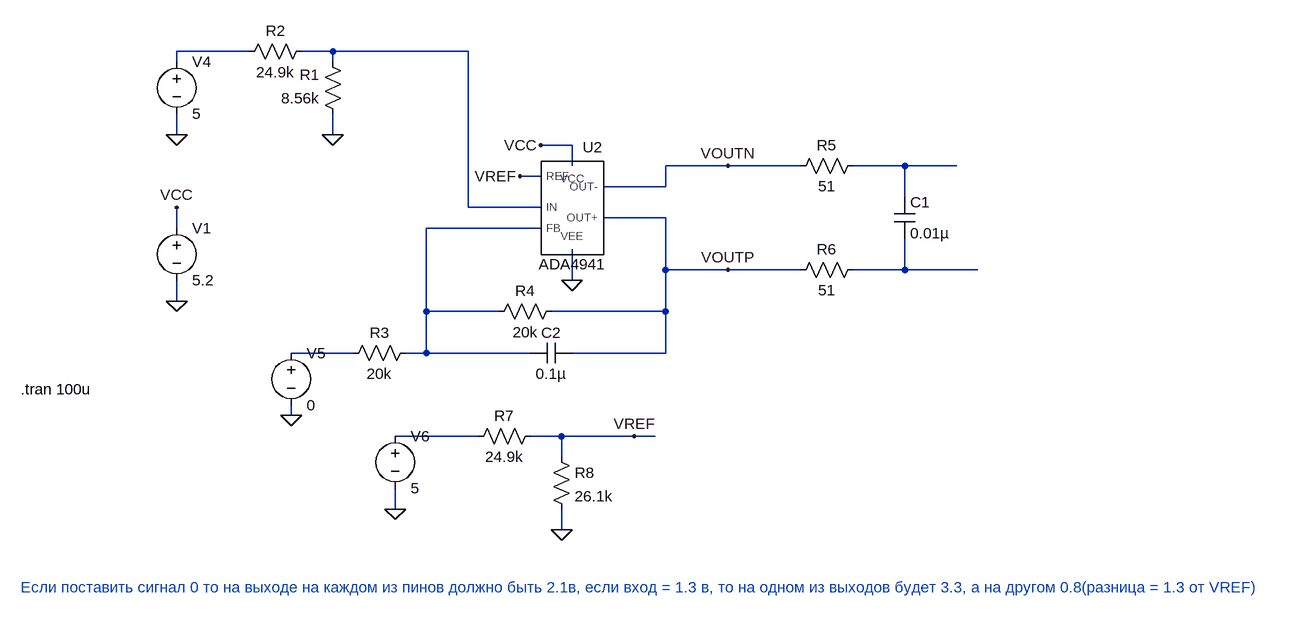
[diagram p0: schematic ADCDriverMEASI.asc]
ADCDriverMEASI.asc, the LTspice schematic file:
Version 4.1
SHEET 1 1264 680
WIRE -448 -208 -560 -208
WIRE -320 -208 -368 -208
WIRE -112 -208 -320 -208
WIRE -560 -192 -560 -208
WIRE -320 -192 -320 -208
WIRE -560 -80 -560 -112
WIRE -320 -80 -320 -112
WIRE 48 -64 0 -64
WIRE 48 -32 48 -64
WIRE 288 -32 192 -32
WIRE 400 -32 288 -32
WIRE 560 -32 480 -32
WIRE 640 -32 560 -32
WIRE 0 -16 -32 -16
WIRE 192 0 192 -32
WIRE 192 0 96 0
WIRE 560 16 560 -32
WIRE -112 32 -112 -208
WIRE 0 32 -112 32
WIRE 192 48 96 48
WIRE -560 64 -560 32
WIRE 0 64 -176 64
WIRE 192 128 192 48
WIRE 288 128 192 128
WIRE 400 128 288 128
WIRE 560 128 560 80
WIRE 560 128 480 128
WIRE 672 128 560 128
WIRE 48 144 48 96
WIRE -560 176 -560 144
WIRE -176 192 -176 64
WIRE -64 192 -176 192
WIRE 192 192 192 128
WIRE 192 192 16 192
WIRE -288 256 -384 256
WIRE -176 256 -176 192
WIRE -176 256 -208 256
WIRE -16 256 -176 256
WIRE 192 256 192 192
WIRE 192 256 48 256
WIRE -384 352 -384 336
WIRE -96 384 -224 384
WIRE 32 384 -16 384
WIRE 144 384 32 384
WIRE 176 384 144 384
WIRE 32 416 32 384
WIRE -224 496 -224 464
WIRE 32 528 32 496
FLAG -560 176 0
FLAG -384 352 0
FLAG 288 -32 VOUTN
FLAG 288 128 VOUTP
FLAG -560 32 VCC
FLAG -320 -80 0
FLAG -224 496 0
FLAG 32 528 0
FLAG 144 384 VREF
FLAG -32 -16 VREF
FLAG -560 -80 0
FLAG 0 -64 VCC
FLAG 48 144 0
SYMBOL voltage -560 48 R0
WINDOW 123 0 0 Left 0
WINDOW 39 0 0 Left 0
SYMATTR InstName V1
SYMATTR Value 5.2
SYMBOL res -304 -96 R180
WINDOW 0 36 76 Left 2
WINDOW 3 36 40 Left 2
SYMATTR InstName R1
SYMATTR Value 8.56k
SYMBOL res -352 -224 R90
WINDOW 0 0 56 VBottom 2
WINDOW 3 32 56 VTop 2
SYMATTR InstName R2
SYMATTR Value 24.9k
SYMBOL res -192 240 R90
WINDOW 0 0 56 VBottom 2
WINDOW 3 32 56 VTop 2
SYMATTR InstName R3
SYMATTR Value 20k
SYMBOL res 32 176 R90
WINDOW 0 0 56 VBottom 2
WINDOW 3 32 56 VTop 2
SYMATTR InstName R4
SYMATTR Value 20k
SYMBOL voltage -384 240 R0
WINDOW 123 0 0 Left 0
WINDOW 39 0 0 Left 0
SYMATTR InstName V5
SYMATTR Value 0
SYMBOL voltage -560 -208 R0
WINDOW 123 0 0 Left 0
WINDOW 39 0 0 Left 0
SYMATTR InstName V4
SYMATTR Value 5
SYMBOL res 496 -48 R90
WINDOW 0 0 56 VBottom 2
WINDOW 3 32 56 VTop 2
SYMATTR InstName R5
SYMATTR Value 51
SYMBOL res 496 112 R90
WINDOW 0 0 56 VBottom 2
WINDOW 3 32 56 VTop 2
SYMATTR InstName R6
SYMATTR Value 51
SYMBOL cap 544 16 R0
SYMATTR InstName C1
SYMATTR Value 0.01µ
SYMBOL res 0 368 R90
WINDOW 0 0 56 VBottom 2
WINDOW 3 32 56 VTop 2
SYMATTR InstName R7
SYMATTR Value 24.9k
SYMBOL res 16 400 R0
SYMATTR InstName R8
SYMATTR Value 26.1k
SYMBOL voltage -224 368 R0
WINDOW 123 0 0 Left 0
WINDOW 39 0 0 Left 0
SYMATTR InstName V6
SYMATTR Value 5
SYMBOL ADA4941 48 32 R0
WINDOW 0 32 -77 Bottom 2
WINDOW 3 0 72 Top 2
SYMATTR InstName U2
SYMBOL cap 48 240 R90
WINDOW 0 0 32 VBottom 2
WINDOW 3 32 32 VTop 2
SYMATTR InstName C2
SYMATTR Value 0.1µ
TEXT -800 312 Left 2 !.tran 100u
TEXT -800 616 Left 2 ;Если поставить сигнал 0 то на выходе на каждом из пинов должно быть 2.1в, если вход = 1.3 в, то на одном из выходов будет 3.3, а на другом 0.8(разница = 1.3 от VREF)

The netlist it stands for:
* ADCDriverMEASI.asc
V1 VCC 0 5.2
R1 0 N002 8.56k
R2 N002 N001 24.9k
R3 N004 N006 20k
R4 VOUTP N004 20k
V5 N006 0 0
V4 N001 0 5
R5 N003 VOUTN 51
R6 N005 VOUTP 51
C1 N003 N005 0.01µ
R7 VREF N007 24.9k
R8 VREF 0 26.1k
V6 N007 0 5
X§U2 N004 VREF VCC VOUTP VOUTN 0 N002 ADA4941  ; pins FB REF VCC OUT+ OUT- VEE IN
C2 VOUTP N004 0.1µ
.tran 100u
* Если поставить сигнал 0 то на выходе на каждом из пинов должно быть 2.1в, если вход = 1.3 в, то на одном из выходов будет 3.3, а на другом 0.8(разница = 1.3 от VREF)
.lib C:\Users\User\Downloads\ada4941.cir
.backanno
.end